# EAGLE design attiny_batsense (EAGLE 8.3.2)
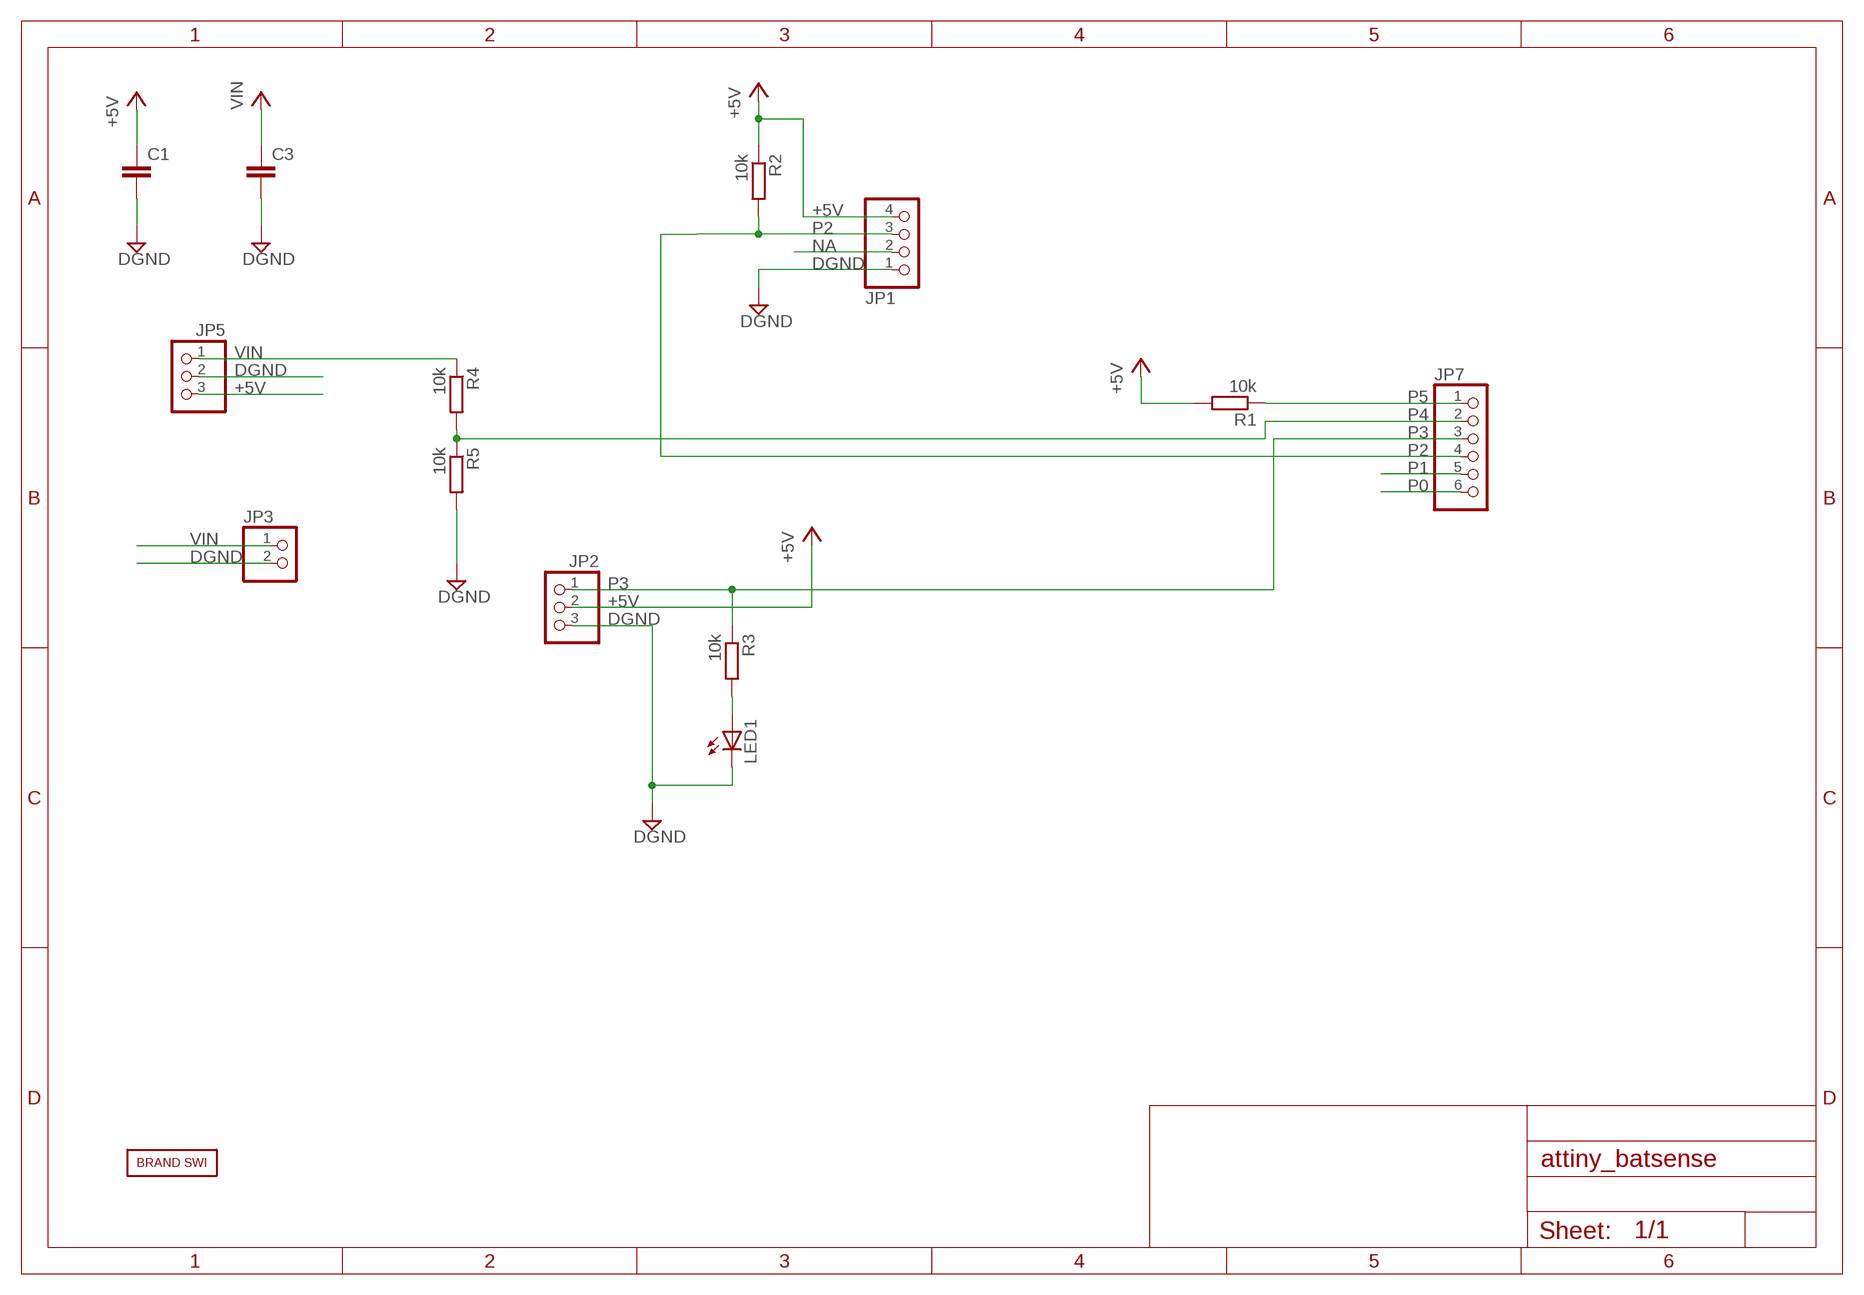
[diagram p0: schematic, sheet 1]

## Parts
C1  C-EUC1210  [C1210]
C3  C-EUC1210  [C1210]
JP1  PINHD-1X4  [1X04]
JP2  PINHD-1X3  [1X03]
JP3  PINHD-1X2  [1X02]
JP5  PINHD-1X3  [1X03]
JP7  PINHD-1X6  [1X06]
LED1  LED3MM  [LED3MM]
R1  10k  R-EU_R0805  [R0805]
R2  10k  R-EU_R0805  [R0805]
R3  10k  R-EU_R0805  [R0805]
R4  10k  R-EU_R0805  [R0805]
R5  10k  R-EU_R0805  [R0805]
U$2  BRAND_SWI5X7  [BRAND_SWI_5X7]

## Nets
+5V: C1.1 JP1.4 JP2.2 JP5.3 R1.2 R2.1
DGND: C1.2 C3.2 JP1.1 JP2.3 JP3.2 JP5.2 LED1.K(C) R5.2
N$2: LED1.A R3.2
NA: JP1.2
P0: JP7.6
P1: JP7.5
P2: JP1.3 JP7.4 R2.2
P3: JP2.1 JP7.3 R3.1
P4: JP7.2 R4.2 R5.1
P5: JP7.1 R1.1
VIN: C3.1 JP3.1 JP5.1 R4.1

## Library data of the parts
C1 C3 = rcl:C-EU: CAPACITOR, European symbol
JP1 = pinhead:PINHD-1X4: PIN HEADER
JP2 JP5 = pinhead:PINHD-1X3: PIN HEADER
JP3 = pinhead:PINHD-1X2: PIN HEADER
JP7 = pinhead:PINHD-1X6: PIN HEADER
LED1 = led:LED: LED OSRAM: - CHIPLED LG R971, LG N971, LY N971, LG Q971, LY Q971, LO R971, LY R971 LH N974, LH R974 LS Q976, LO Q976, LY Q976 LO Q996 - Hyper CHIPLED LW Q18S LB Q993, LB Q99A, LB R99A - SideLED LS A670, LO A670, LY A670, LG A670, LP A670 LB A673, LV A673, LT A673, LW A673 LH A674 LY A675 LS A676, LA A676, LO A676, LY A676, LW A676 LS A679, LY A679, LG A679 - Hyper Micro SIDELED® LS Y876, LA Y876, LO Y876, LY Y876 LT Y87S - SmartLED LW L88C, LW L88S LB L89C, LB L89S, LG L890 LS L89K, LO L89K, LY L89K LS L896, LA L896, LO L896, LY L896 - TOPLED LS T670, LO T670, LY T670, LG T670, LP T670 LSG T670, LSP T670, LSY T670, LOP T670, LYG T670 LG T671, LOG T671, LSG T671 LB T673, LV T673, LT T673, LW T673 LH T674 LS T676, LA T676, LO T676, LY T676, LB T676, LH T676, LSB T676, LW T676 LB T67C, LV T67C, LT T67C, LS T67K, LO T67K, LY T67K, LW E67C LS E67B, LA E67B, LO E67B, LY E67B, LB E67C, LV E67C, LT E67C LW T67C LS T679, LY T679, LG T679 LS T770, LO T770, LY T770, LG T770, LP T770 LB T773, LV T773, LT T773, LW T773 LH T774 LS E675, LA E675, LY E675, LS T675 LS T776, LA T776, LO T776, LY T776, LB T776 LHGB T686 LT T68C, LB T68C - Hyper Mini TOPLED® LB M676 - Mini TOPLED Santana® LG M470 LS M47K, LO M47K, LY M47K Source: http://www.osram.convergy.de LUXEON: - LUMILED® LXK2-PW12-R00, LXK2-PW12-S00, LXK2-PW14-U00, LXK2-PW14-V00 LXK2-PM12-R00, LXK2-PM12-S00, LXK2-PM14-U00 LXK2-PE12-Q00, LXK2-PE12-R00, LXK2-PE12-S00, LXK2-PE14-T00, LXK2-PE14-U00 LXK2-PB12-K00, LXK2-PB12-L00, LXK2-PB12-M00, LXK2-PB14-N00, LXK2-PB14-P00, LXK2-PB14-Q00 LXK2-PR12-L00, LXK2-PR12-M00, LXK2-PR14-Q00, LXK2-PR14-R00 LXK2-PD12-Q00, LXK2-PD12-R00, LXK2-PD12-S00 LXK2-PH12-R00, LXK2-PH12-S00 LXK2-PL12-P00, LXK2-PL12-Q00, LXK2-PL12-R00 Source: www.luxeon.com KINGBRIGHT: KA-3528ASYC Source: www.kingbright.com
R1-R5 = rcl:R-EU_: RESISTOR, European symbol
U$2 = BRAND_SWI:BRAND_SWI

## Board
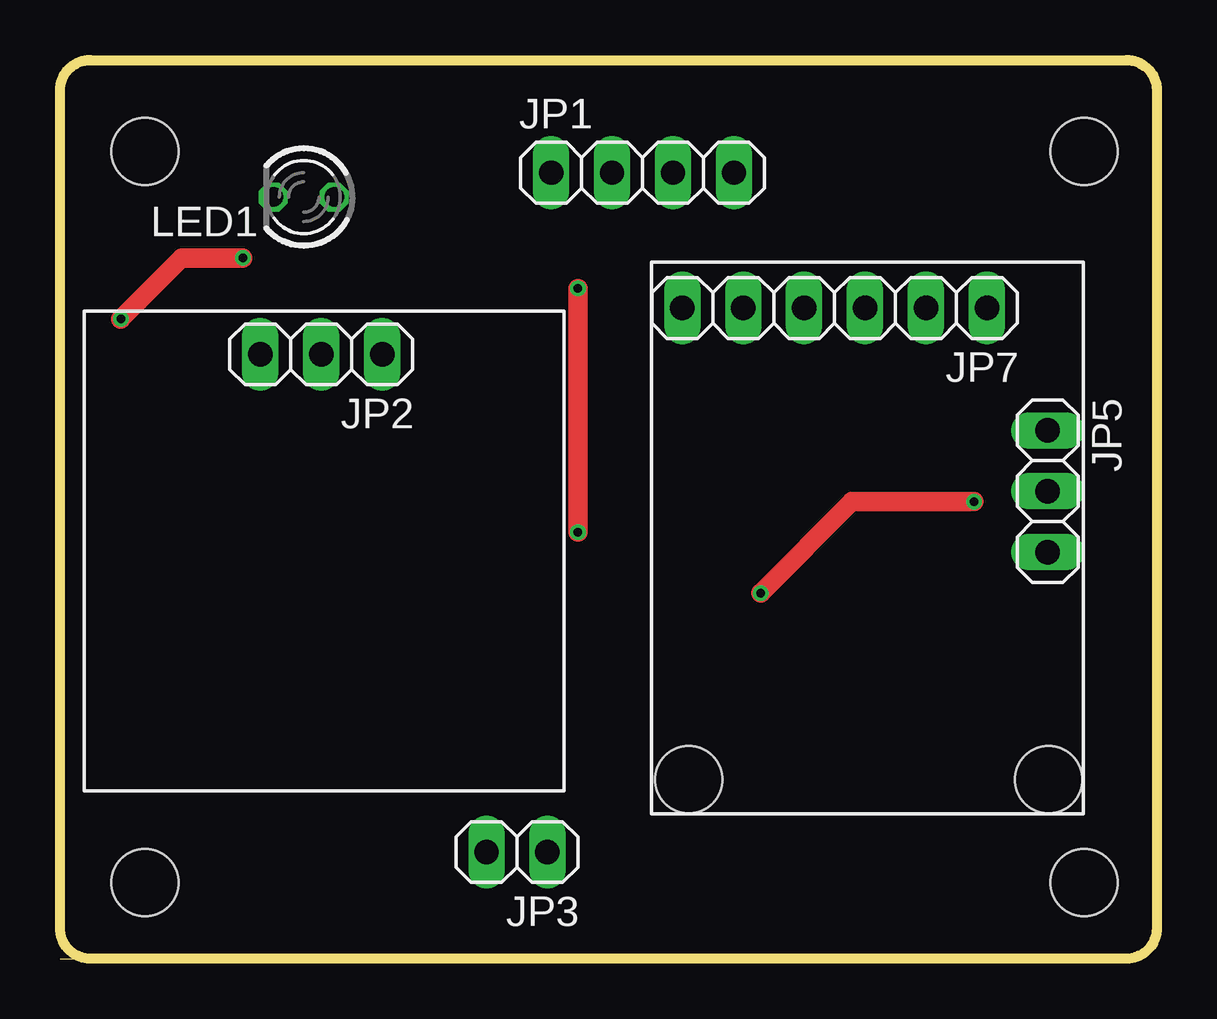
[diagram p1: board, top side]
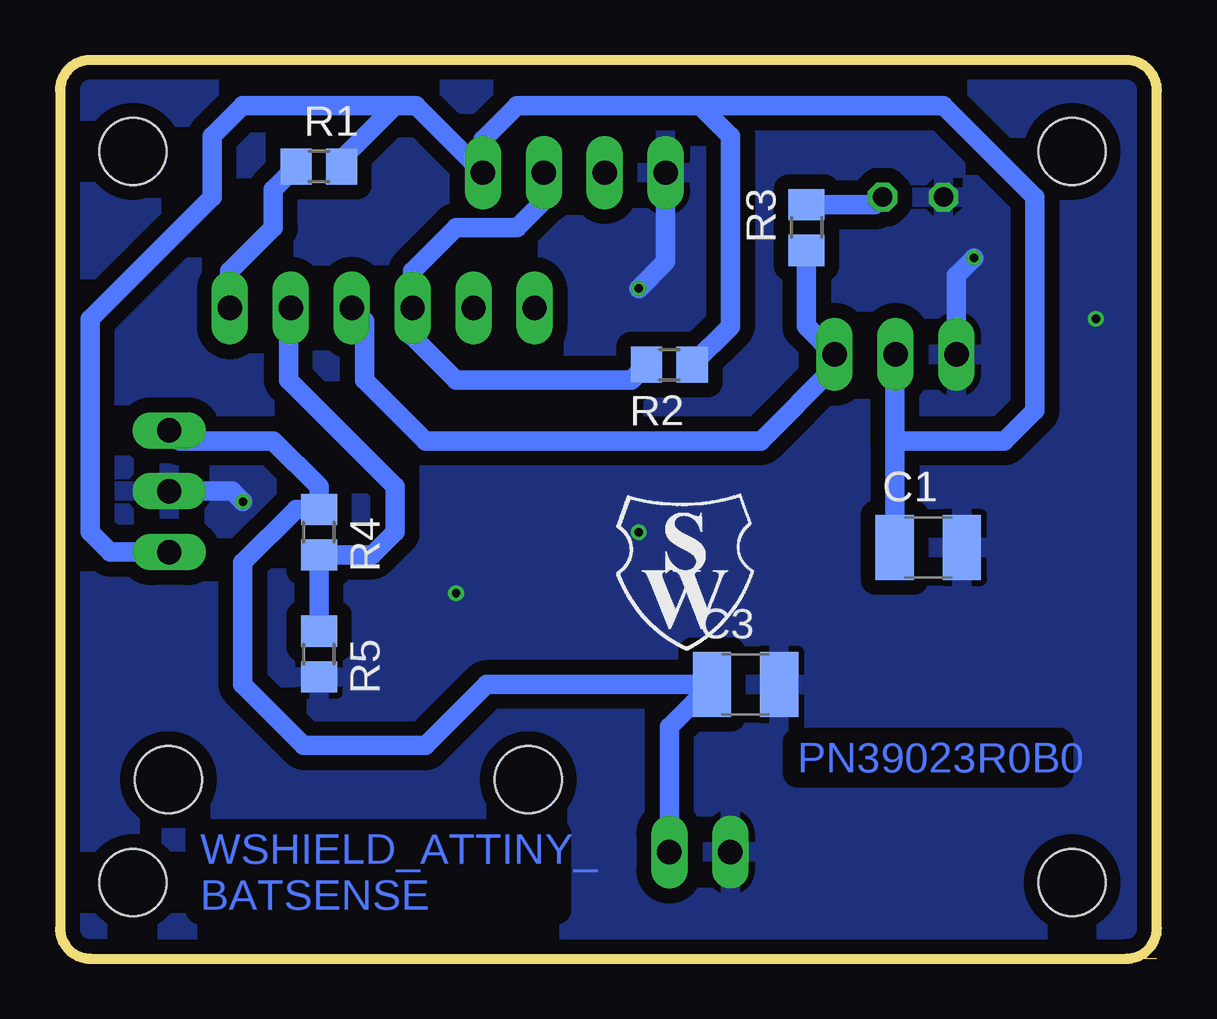
[diagram p2: board, bottom side, seen from below]

Size 45.72 x 37.47 mm. Coordinates in mm from the lower left corner, seen from the top.
Outline: 0,0 1.27,0
Outline: 1.27,0 2.03,0
Outline: 28.45,0 31.42,0
Outline: 1.27,0 44.45,0 arc90 45.72,1.27 45.72,36.2 arc90 44.45,37.47 1.27,37.47 arc90 0,36.2 0,1.27 arc90 1.27,0
Copper layers (1*16): Top 0.035mm / dielectric 1.6mm / Bottom 0.035mm
Design rules "Elecrow_2-layer_PCB_eagle_rule *": minimum track width 12mil, minimum drill 12mil, track to track 6mil, track to pad 6mil, pad to pad 6mil, via to via 8mil, smd to smd 0mil, copper to edge 20mil, drill to drill 10mil, minimum pad ring 6mil, minimum via ring 6mil, stop-mask expansion 0mil, vias tented up to drill 100mil, thermal gap 10mil
Holes 2.8 mm at 3.54,33.66 42.68,33.66 42.68,3.17 3.54,3.17 26.2,7.46 41.2,7.46

### Footprints (pad centres in the part's own frame; a part is rotated, then mirrored left to right if it is on the bottom)
C1210 = smd 1.6 x 2.7: 1 -1.4,0; 2 1.4,0
1X04 = drill 1.016 long: 1 -3.81,0; 2 -1.27,0; 3 1.27,0; 4 3.81,0
1X03 = drill 1.016 long: 1 -2.54,0; 2 0,0; 3 2.54,0
1X02 = drill 1.016 long: 1 -1.27,0; 2 1.27,0
1X06 = drill 1.016 long: 1 -6.35,0; 2 -3.81,0; 3 -1.27,0; 4 1.27,0; 5 3.81,0; 6 6.35,0
LED3MM = drill 0.813 octagon: A -1.27,0; K 1.27,0
R0805 = smd 1.3 x 1.5: 1 -0.95,0; 2 0.95,0

### Placement (x,y rotation side)
C1  9.53,17.14 0 bottom
C3  17.14,11.43 0 bottom
JP1  24.28,32.77 0 top
JP2  10.89,25.19 180 top
JP3  19.05,4.45 180 top
JP5  41.17,19.49 270 top
JP7  32.29,27.13 180 top
LED1  10.16,31.75 180 top
R1  34.92,33.02 0 bottom
R2  20.32,24.77 180 bottom
R3  14.61,30.48 90 bottom
R4  34.92,17.78 270 bottom
R5  34.92,12.7 270 bottom
U$2  22.73,12.7 0 bottom

### Tracks (layer width: path | path; a pad name or v marks a point on that pad's centre or on a via)
+5V
  Bottom 0.813: JP5.3 43.62,16.95 44.45,17.78 44.45,26.67 39.37,31.75 39.37,34.29 38.1,35.56 31.75,35.56 | R1.2 33.98,33.34 31.75,35.56 | JP2.2 10.79,25.1 10.93,24.97 10.93,21.59 | 10.93,21.59 C1.1 | 31.75,35.56 30.89,35.56 JP1.4 28.09,34.14 26.67,35.56 19.05,35.56 | 19.05,35.56 17.78,34.29 17.78,26.36 R2.1 | 19.05,35.56 8.89,35.56 5.08,31.75 5.08,22.86 6.35,21.59 10.93,21.59
DGND  (via drill 0.35)
  Top 0.813: v38.1,19.05 33.02,19.05 v29.21,15.24 | v7.62,29.21 5.08,29.21 v2.54,26.67 | v21.59,27.94 v21.59,17.78
  Bottom 0.813: JP5.2 38.54,19.49 v38.1,19.05 | JP2.3 8.35,28.48 v7.62,29.21 | JP1.1 20.47,29.06 v21.59,27.94
  pour Bottom (isolate 0.61): 0,0 0,36.83 0.64,37.47 45.09,37.47 45.72,36.83 45.72,0.64 45.09,0
N$2
  Bottom 0.813: R3.2 11.75,31.43 LED1.A
P2
  Bottom 0.813: R2.2 21.91,24.13 29.21,24.13 31.02,25.94 JP7.4 31.02,28.67 29.21,30.48 26.67,30.48 25.4,31.75 25.4,32.61 JP1.3
P3
  Bottom 0.813: R3.1 14.61,26.37 JP2.1 13.43,24.67 16.51,21.59 30.48,21.59 33.02,24.13 33.02,26.59 JP7.3
P4
  Bottom 0.813: R5.1 R4.2 32.7,16.83 31.75,17.78 31.75,19.68 36.2,24.13 36.2,27.04 JP7.2
P5
  Bottom 0.813: JP7.1 38.64,28.67 36.83,30.48 36.83,32.06 R1.1
VIN
  Bottom 0.813: JP5.1 40.73,21.59 36.83,21.59 34.92,19.68 R4.1 35.88,18.73 38.1,16.51 38.1,11.43 35.56,8.89 30.48,8.89 27.94,11.43 C3.1 20.32,9.65 JP3.1

### Text on the board
Bottom: PN39023R0B0 | WSHIELD_ATTINY_ / BATSENSE